# EAGLE schematic 7seg multiplexer (EAGLE 6.6.0)
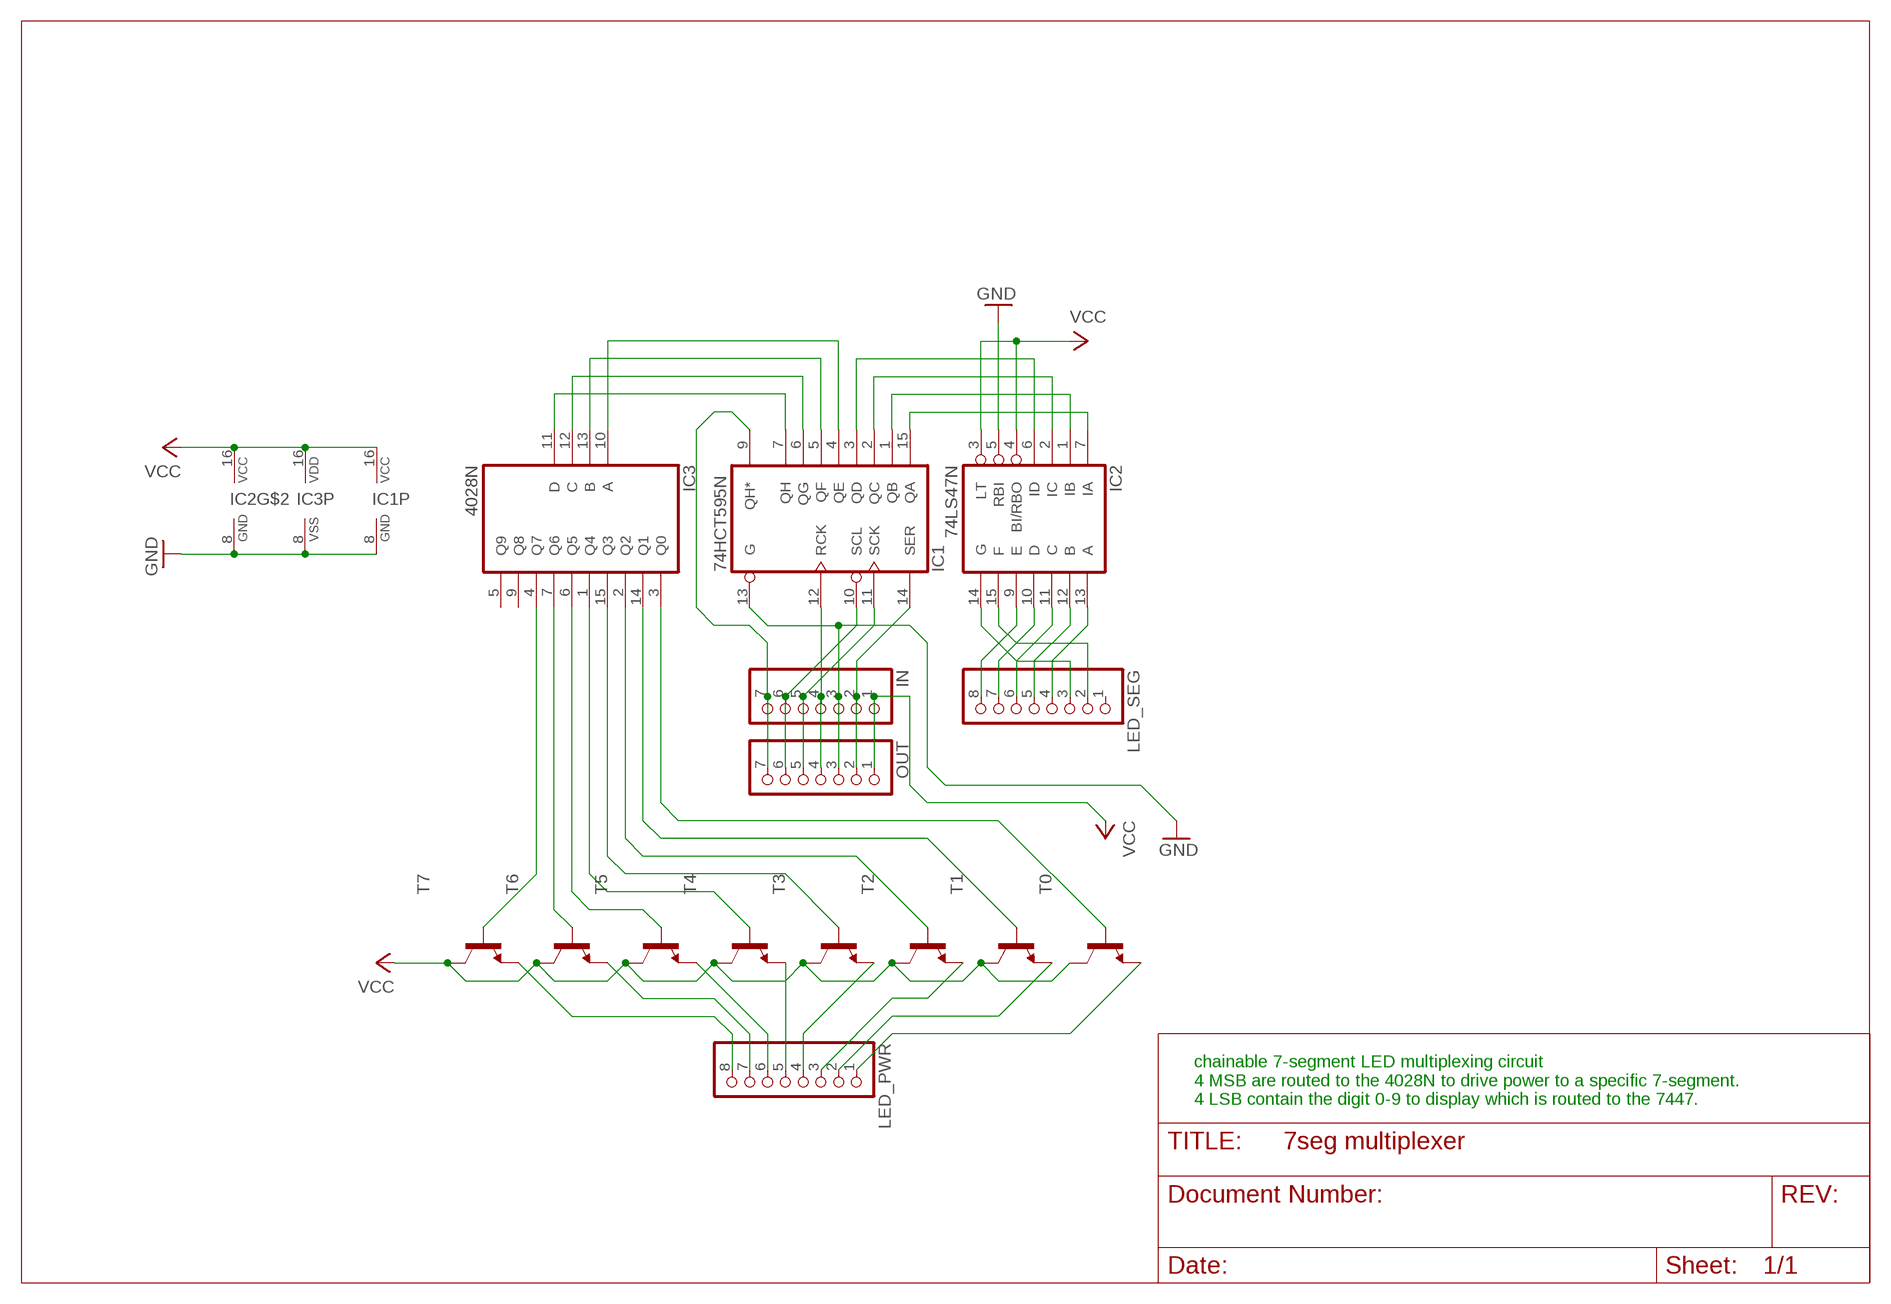
[diagram p0: schematic, sheet 1]

## Parts
IC1  74HCT595N  [DIL16]
IC2  74LS47N  [DIL16]
IC3  4028N  [DIL16]
IN  PINHD-1X7  [1X07]
LED_PWR  PINHD-1X8  [1X08]
LED_SEG  PINHD-1X8  [1X08]
OUT  PINHD-1X7  [1X07]
T0  2N3904-NPN-TO92-EBC  [TO92-EBC]
T1  2N3904-NPN-TO92-EBC  [TO92-EBC]
T2  2N3904-NPN-TO92-EBC  [TO92-EBC]
T3  2N3904-NPN-TO92-EBC  [TO92-EBC]
T4  2N3904-NPN-TO92-EBC  [TO92-EBC]
T5  2N3904-NPN-TO92-EBC  [TO92-EBC]
T6  2N3904-NPN-TO92-EBC  [TO92-EBC]
T7  2N3904-NPN-TO92-EBC  [TO92-EBC]

## Nets
GND: IC1.8(GND) IC1.13(G) IC2.5(RBI) IC2.8(GND) IC3.8(VSS) IN.3 OUT.3
N$1: IC1.15(QA) IC2.7(IA)
N$2: IC1.1(QB) IC2.1(IB)
N$3: IC1.2(QC) IC2.2(IC)
N$4: IC1.3(QD) IC2.6(ID)
N$5: IC2.9(E) LED_SEG.8
N$6: IC2.10(D) LED_SEG.7
N$7: IC2.11(C) LED_SEG.6
N$8: IC2.12(B) LED_SEG.5
N$9: IC2.13(A) LED_SEG.4
N$10: IC2.15(F) LED_SEG.2
N$11: IC2.14(G) LED_SEG.3
N$12: IC1.4(QE) IC3.10(A)
N$13: IC1.5(QF) IC3.13(B)
N$14: IC1.6(QG) IC3.12(C)
N$15: IC1.7(QH) IC3.11(D)
N$16: IC1.9(QH*) IN.7 OUT.7
N$17: IC3.4(Q7) T7.B
N$18: IC3.7(Q6) T6.B
N$19: IC3.6(Q5) T5.B
N$20: IC3.1(Q4) T4.B
N$21: IC3.15(Q3) T3.B
N$22: IC3.2(Q2) T2.B
N$23: IC3.14(Q1) T1.B
N$24: IC3.3(Q0) T0.B
N$25: LED_PWR.1 T0.E
N$26: LED_PWR.2 T1.E
N$27: LED_PWR.3 T2.E
N$28: LED_PWR.4 T3.E
N$29: LED_PWR.5 T4.E
N$30: LED_PWR.6 T5.E
N$31: LED_PWR.7 T6.E
N$32: LED_PWR.8 T7.E
N$33: IC1.10(SCL) IN.6 OUT.6
N$34: IC1.11(SCK) IN.5 OUT.5
N$35: IC1.12(RCK) IN.4 OUT.4
N$37: IC1.14(SER) IN.2 OUT.2
VCC: IC1.16(VCC) IC2.3(LT) IC2.4(BI/RBO) IC2.16(VCC) IC3.16(VDD) IN.1 OUT.1 T0.C T1.C T2.C T3.C T4.C T5.C T6.C T7.C
Unconnected: IC3.5(Q9) IC3.9(Q8) LED_SEG.1

## Notes on the sheet
- chainable 7-segment LED multiplexing circuit
  4 MSB are routed to the 4028N to drive power to a specific 7-segment.
  4 LSB contain the digit 0-9 to display which is routed to the 7447.

## Library data of the parts
IC1 = 74xx-eu:74*595: 8-bit SHIFT REGISTER, output latch
IC2 = 74xx-eu:74*47: BCD to seven segment DECODER/DRIVER Source: http://www.ee.washington.edu/stores/DataSheets/74ls/74ls47.pdf
IC3 = 40xx:4028: BCD to decimal DECODER
IN OUT = pinhead:PINHD-1X7: PIN HEADER
LED_PWR LED_SEG = pinhead:PINHD-1X8: PIN HEADER
T0 T1-T7 = transistor-neu-to92:*-NPN-: NPN Transistror